# EasyEDA schematic rev.1- projecto.json
TITLE: Portable Game Console; REV: 1.0; Date: 2021-06-05; Sheet: 1/1; Drawn By: Francisco Marques; Company: ISEL - Projeto 20/21
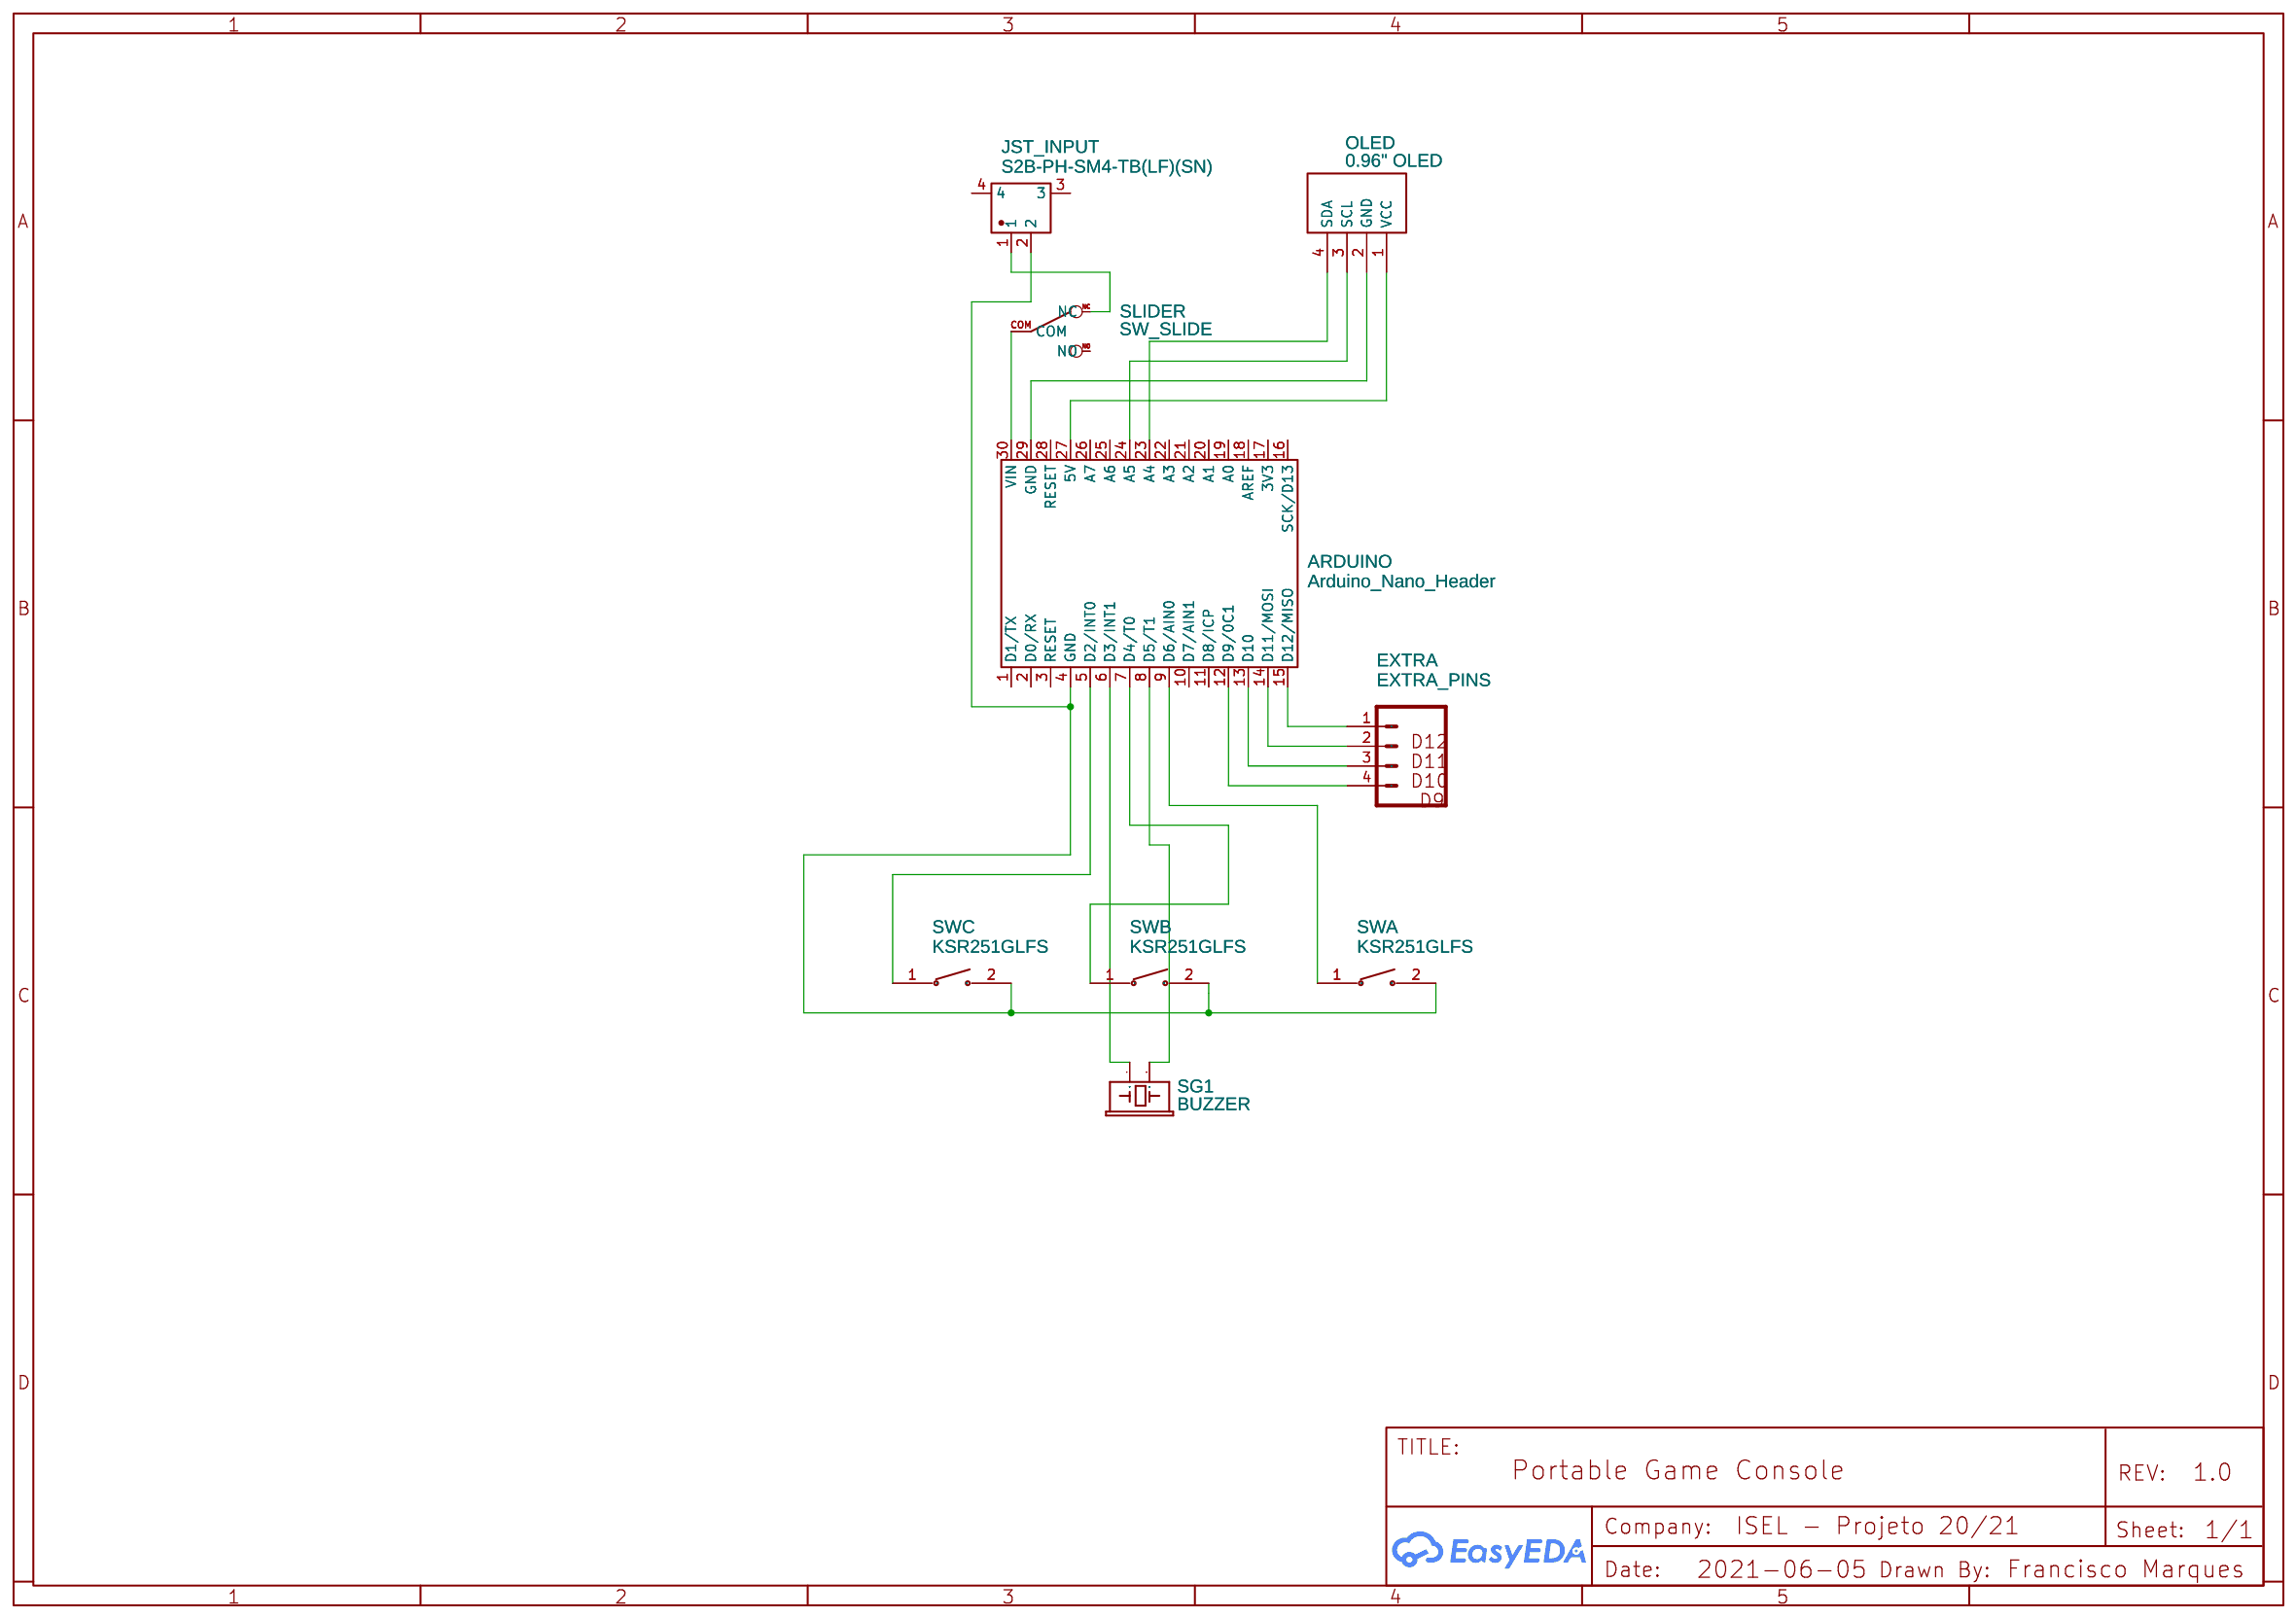
[diagram p0: schematic sheet]

## Parts
ARDUINO  Arduino_Nano_Header  [DIP-30_L43.18-W15.24-ARDUINONANO]
EXTRA  EXTRA_PINS  [EXTRA_PINS_FOOTPRINT]
JST_INPUT  S2B-PH-SM4-TB(LF)(SN)  [CONN-SMD_P2.00_S2B-PH-SM4-TB-LF-SN]
OLED  0.96" OLED  [0.96 OLED]
SG1  BUZZER  [BUZZER-12MM]
SLIDER  SW_SLIDE  [SLIDE_SWITCH_SMD]
SWA  KSR251GLFS  [KEY-SMD_2P-L6.0-W3.8-P7.30-L]
SWB  KSR251GLFS  [KEY-SMD_2P-L6.0-W3.8-P7.30-L]
SWC  KSR251GLFS  [KEY-SMD_2P-L6.0-W3.8-P7.30-L]

## Library data of the parts
ARDUINO = Arduino_Nano_Header
EXTRA = EXTRA_PINS: SparkFun has standardized on a pinout for all I2C based sensor breakouts.; Contributor: SparkFun
JST_INPUT = S2B-PH-SM4-TB(LF)(SN): Supplier: LCSC; Supplier Part: C295747; Manufacturer: JST Sales America; Contributor: LCSC
OLED = 0.96" OLED: Contributor: FreakyFunky
SG1 = BUZZER: Contributor: SparkFun
SLIDER = SW_SLIDE: Contributor: DangerousPrototype
SWA SWB SWC = KSR251GLFS: Supplier: LCSC; Supplier Part: C221790; Manufacturer: C&K; Contributor: LCSC; JLCPCB Part Class: Extended Part

## Nets
Net-(ARDUINO-4): ARDUINO.4(GND) JST_INPUT.2 SWA.2 SWB.2 SWC.2
Net-(ARDUINO-5): ARDUINO.5(D2/INT0) SWC.1
Net-(ARDUINO-6): ARDUINO.6(D3/INT1) SG1.-(2)
Net-(ARDUINO-7): ARDUINO.7(D4/T0) SWB.1
Net-(ARDUINO-8): ARDUINO.8(D5/T1) SG1.+(1)
Net-(ARDUINO-9): ARDUINO.9(D6/AIN0) SWA.1
Net-(ARDUINO-12): ARDUINO.12(D9/0C1) EXTRA.4
Net-(ARDUINO-13): ARDUINO.13(D10) EXTRA.3
Net-(ARDUINO-14): ARDUINO.14(D11/MOSI) EXTRA.2
Net-(ARDUINO-15): ARDUINO.15(D12/MISO) EXTRA.1
Net-(ARDUINO-23): ARDUINO.23(A4) OLED.4(SDA)
Net-(ARDUINO-24): ARDUINO.24(A5) OLED.3(SCL)
Net-(ARDUINO-27): ARDUINO.27(5V) OLED.1(VCC)
Net-(ARDUINO-29): ARDUINO.29(GND) OLED.2(GND)
Net-(ARDUINO-30): ARDUINO.30(VIN) SLIDER.COM
Net-(JST_INPUT-1): JST_INPUT.1 SLIDER.NC

Not connected (* = marked no-connect by the designer): ARDUINO 1(D1/TX) 2(D0/RX) 3(RESET) 10(D7/AIN1) 11(D8/ICP) 16(SCK/D13) 17(3V3) 18(AREF) 19(A0) 20(A1) 21(A2) 22(A3) 25(A6) 26(A7) 28(RESET); JST_INPUT 3 4; SLIDER NO
